# EAGLE design Weather Box (EAGLE 8.5.2)
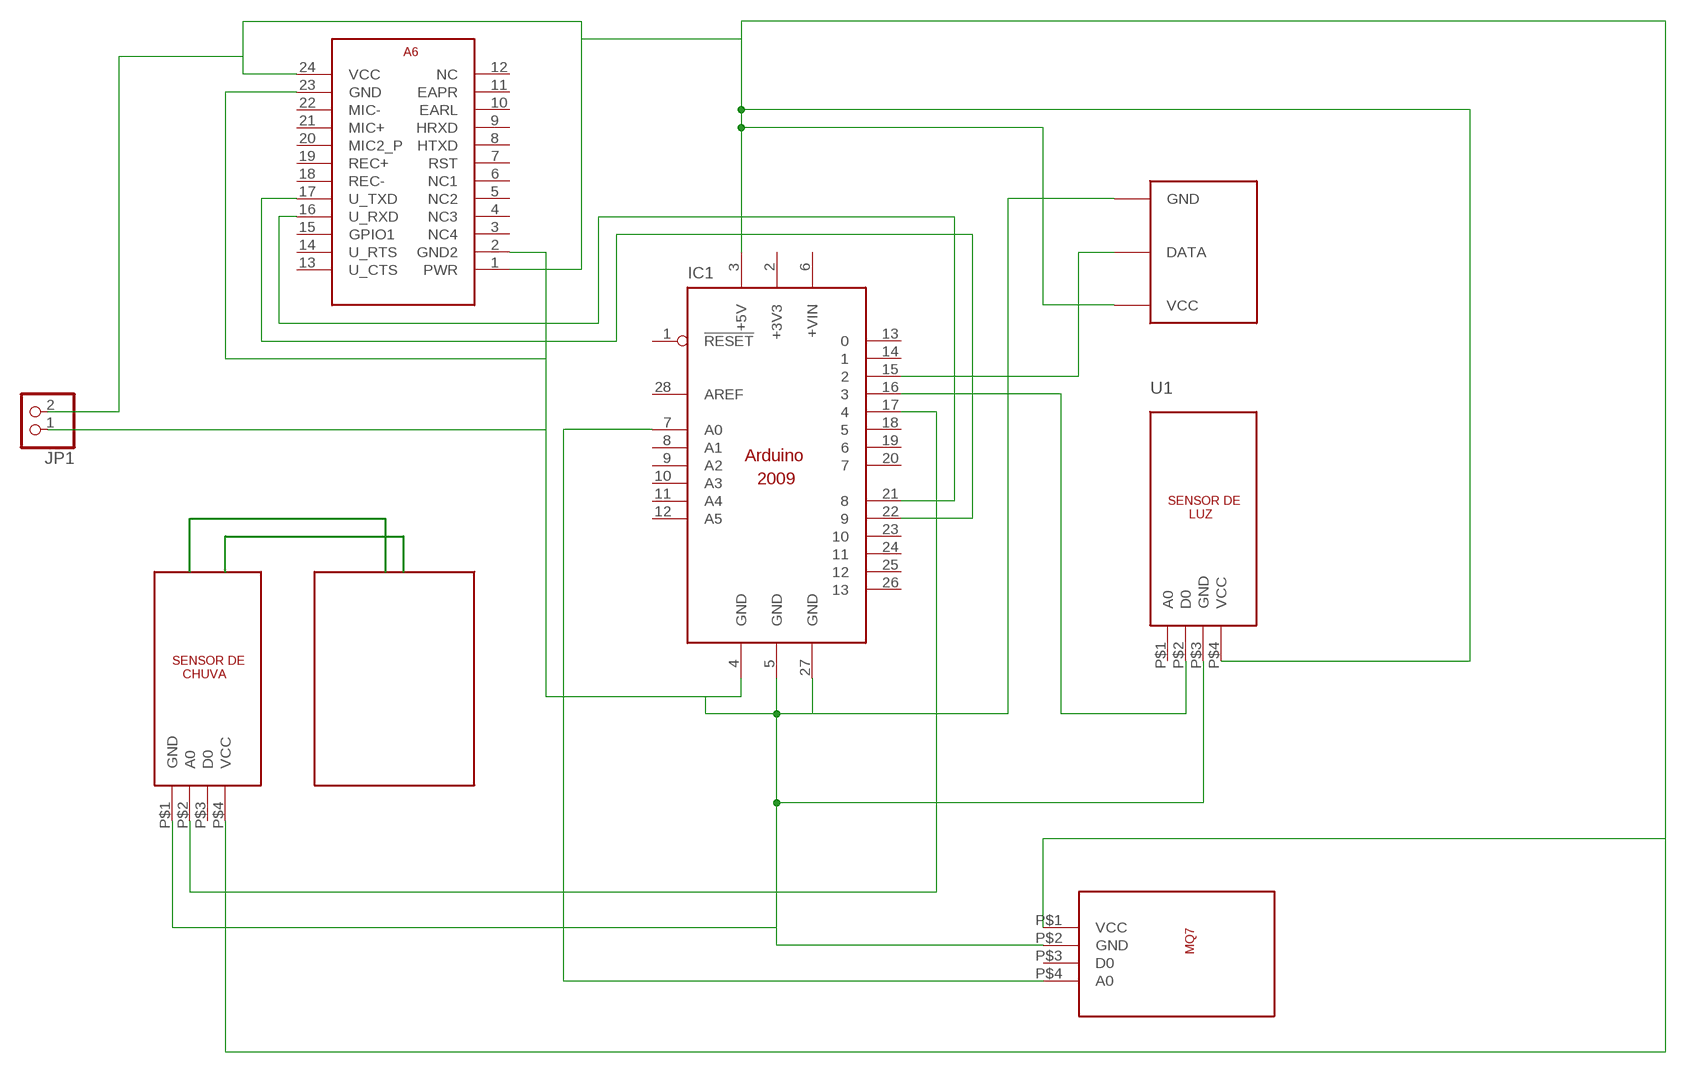
[diagram p0: schematic, sheet 1]

## Parts
IC1  ARDUINO2009_10  [ARDUINO2009]
JP1  PINHD-1X2  [1X02]
SHT1  DHT11DHT11-UPRIGHT  [DHT11-UP]
U1  LDRLDR-UPRIGHT  [LDR-UP]
U2  A6GPRS  [A6_MODULE_V3]
U3  RAINLDR-UPRIGHT  [RAIN-UP]
U4  MQ7MQ7-UPRIGHT  [MQ7-UP]

## Nets
N$1: IC1.7(A0) U4.P$4(A0)
N$3: IC1.3(+5V) JP1.2 SHT1.P$1(VCC) U1.P$4(VCC) U2.1(PWR) U2.24(VCC) U3.P$4(VCC) U4.P$1(VCC)
N$5: IC1.22 U2.17(U_TXD)
N$6: IC1.21 U2.16(U_RXD)
N$7: IC1.4(GND) IC1.5(GND) IC1.27(GND) JP1.1 SHT1.P$4(GND) U1.P$3(GND) U2.2(GND2) U2.23(GND) U3.P$1(GND) U4.P$2(GND)
N$9: IC1.17 U3.P$2(A0)
N$13: IC1.16 U1.P$2(D0)
N$14: IC1.15 SHT1.P$3(DATA)
Unconnected: IC1.1(!RESET) IC1.6(+VIN) IC1.8(A1) IC1.9(A2) IC1.10(A3) IC1.11(A4) IC1.12(A5) IC1.13 IC1.14 IC1.18 IC1.19 IC1.20 IC1.23 IC1.24 IC1.25 IC1.26 IC1.28(AREF) U1.P$1(A0) U2.3(NC4) U2.4(NC3) U2.5(NC2) U2.6(NC1) U2.7(RST) U2.8(HTXD) U2.9(HRXD) U2.10(EARL) U2.11(EAPR) U2.12(NC) U2.13(U_CTS) U2.14(U_RTS) U2.15(GPIO1) U2.18(REC-) U2.19(REC+) U2.20(MIC2_P) U2.21(MIC+) U2.22(MIC-) U3.P$3(D0) U4.P$3(D0)

## Power pins joined to a net without a drawn wire
+3V3: IC1.2(+3V3)

## Library data of the parts
IC1 = arduino:ARDUINO2009_1: The Arduino Duemilanove ("2009") is a microcontroller board based on the ATmega168 or ATmega328. - 14 digital input/output pins (of which 6 can be used as PWM outputs) - 6 analog inputs, a 16 MHz crystal oscillator - USB connection - power jack - ISP header - reset button It contains everything needed to support the microcontroller; simply connect it to a computer with a USB cable or power it with a AC-to-DC adapter or battery to get started http://arduino.cc/en/Main/ArduinoBoardDuemilanove
JP1 = pinhead:PINHD-1X2: PIN HEADER
SHT1 = DHT11:DHT11
U1 = Sensor de Luz:LDR
U2 = A6 gprs:A6GPRS
U3 = Sensor de chuva:RAIN
U4 = MQ7:MQ7

## Board
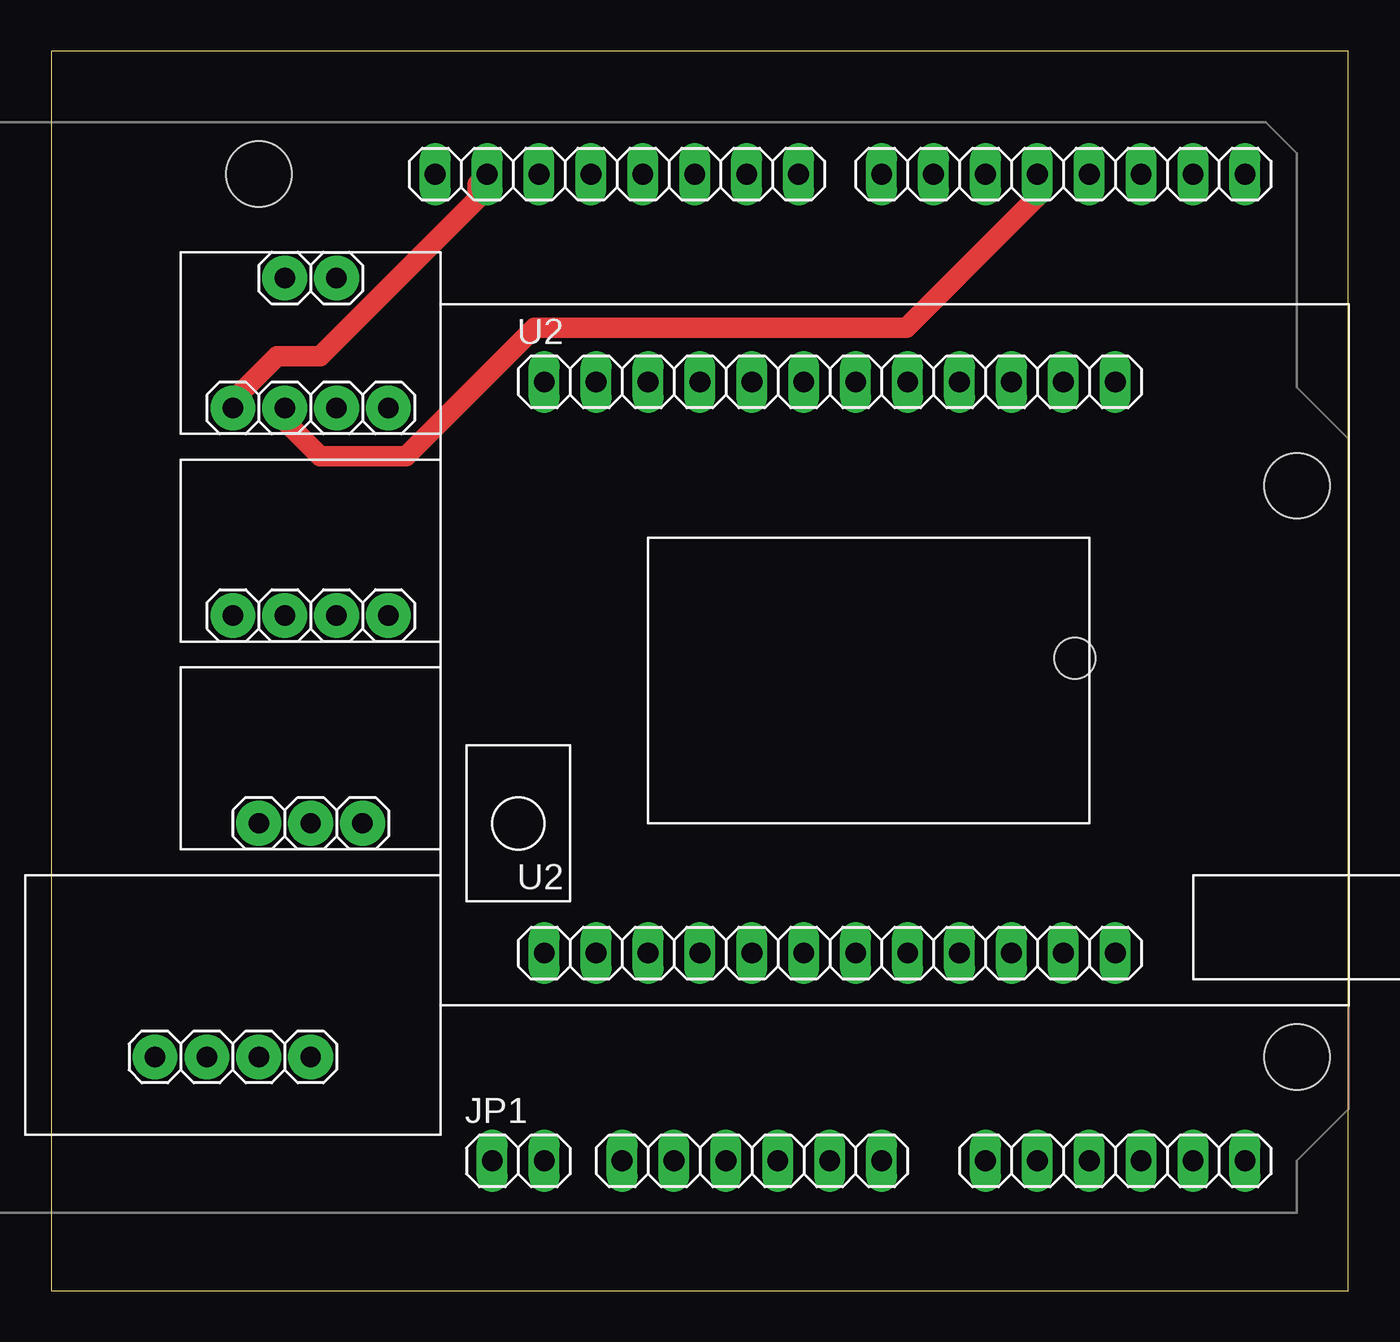
[diagram p1: board, top side]
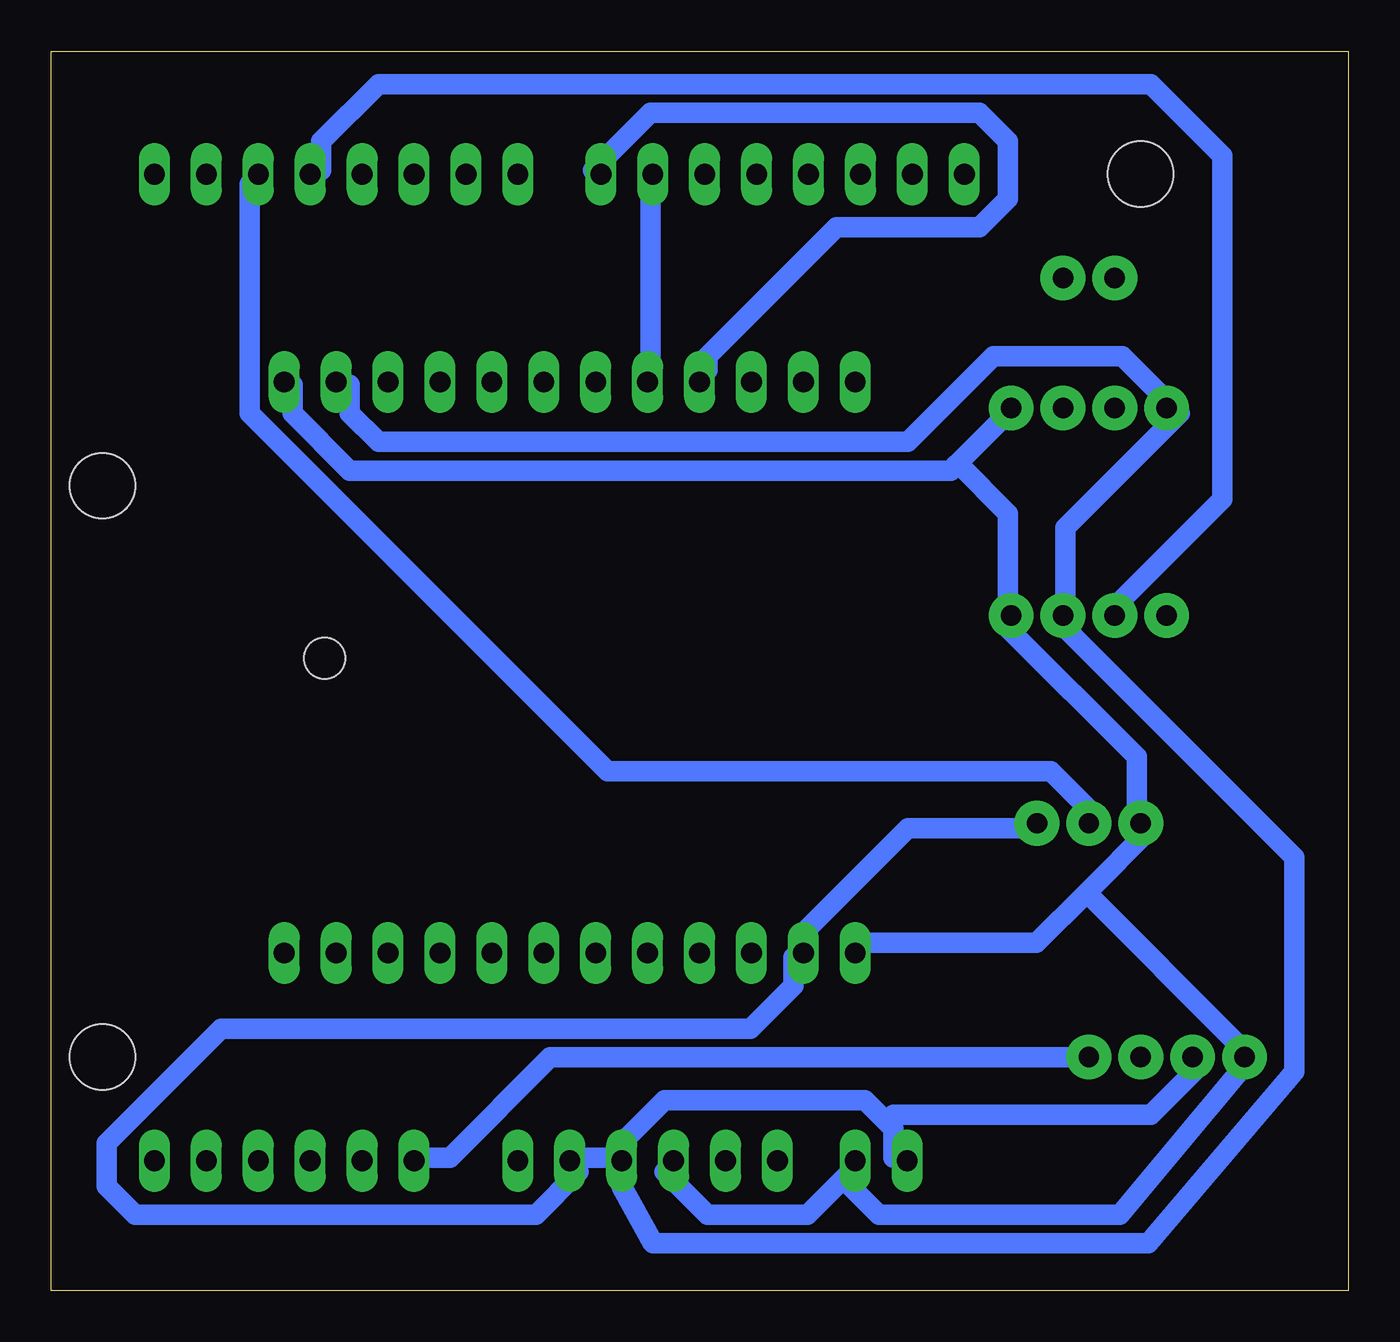
[diagram p2: board, bottom side, seen from below]

Size 63.48 x 60.63 mm. Coordinates in mm from the lower left corner, seen from the top.
Outline: 0,0 63.48,0 63.48,60.63 0,60.63 0,0
Copper layers (1*16): Top 0.035mm / dielectric 1.5mm / Bottom 0.035mm
Design rules "default *": minimum track width 1mm, minimum drill 0.35mm, track to track 0.4mm, track to pad 0.4mm, pad to pad 0.4mm, via to via 0.4mm, smd to smd 0.4mm, copper to edge 40mil, drill to drill 6mil, minimum pad ring 10mil, minimum via ring 8mil, stop-mask expansion 4mil, vias tented up to drill 0mil, thermal gap 10mil

### Footprints (pad centres in the part's own frame; a part is rotated, then mirrored left to right if it is on the bottom)
ARDUINO2009 = drill 1.016 long: 1 33.02,2.54; 2 35.56,2.54; 3 38.1,2.54; 4 40.64,2.54; 5 43.18,2.54; 6 45.72,2.54; 7 50.8,2.54; 8 53.34,2.54; 9 55.88,2.54; 10 58.42,2.54; 11 60.96,2.54; 12 63.5,2.54; 13 63.5,50.8; 14 60.96,50.8; 15 58.42,50.8; 16 55.88,50.8; 17 53.34,50.8; 18 50.8,50.8; 19 48.26,50.8; 20 45.72,50.8; 21 41.656,50.8; 22 39.116,50.8; 23 36.576,50.8; 24 34.036,50.8; 25 31.496,50.8; 26 28.956,50.8; 27 26.416,50.8; 28 23.876,50.8 | hole 3.2: 15.24,50.8; 66.04,35.56; 66.04,7.62 | hole 2: 55.17,27.114
1X02 = drill 1.016 long: 1 -1.27,0; 2 1.27,0
DHT11-UP = drill 1 pad 2.184: P$1 -1.27,0; P$3 1.27,0; P$4 3.81,0
LDR-UP = drill 1 pad 2.184: P$1 -2.54,0; P$2 0,0; P$3 2.54,0; P$4 5.08,0
A6_MODULE_V3 = drill 1.016 long: 1 -16.51,-13.97; 2 -13.97,-13.97; 3 -11.43,-13.97; 4 -8.89,-13.97; 5 -6.35,-13.97; 6 -3.81,-13.97; 7 -1.27,-13.97; 8 1.27,-13.97; 9 3.81,-13.97; 10 6.35,-13.97; 11 8.89,-13.97; 12 11.43,-13.97; 13 -16.51,13.97; 14 -13.97,13.97; 15 -11.43,13.97; 16 -8.89,13.97; 17 -6.35,13.97; 18 -3.81,13.97; 19 -1.27,13.97; 20 1.27,13.97; 21 3.81,13.97; 22 6.35,13.97; 23 8.89,13.97; 24 11.43,13.97
RAIN-UP = drill 1 pad 2.184: P$1 -2.54,0; P$2 0,0; P$3 2.54,0; P$4 5.08,0; P$5 0,6.35; P$6 2.54,6.35
MQ7-UP = drill 1 pad 2.184: P$1 -2.54,2.54; P$2 0,2.54; P$3 2.54,2.54; P$4 5.08,2.54

### Placement (x,y rotation side)
IC1  -5.08,3.81 0 top
JP1  22.86,6.35 0 top
SHT1  11.43,22.86 0 top
U1  11.43,33.02 0 top
U2  40.64,30.48 0 top
U3  11.43,43.18 0 top
U4  7.62,8.89 0 top

### Tracks (layer width: path | path; a pad name or v marks a point on that pad's centre or on a via)
N$1
  Bottom 1: IC1.7 45.36,6.51 43.96,6.51 39.06,11.41 13.16,11.41 U4.P$4
N$3
  Bottom 1: IC1.3 33.46,5.81 31.36,3.71 26.46,3.71 24.36,5.81 JP1.2 24.36,5.11 22.96,3.71 11.19,3.71 4.76,11.41 U4.P$1 5.46,12.11 12.81,19.46 | 12.81,19.46 9.66,22.61 SHT1.P$1 10.36,23.31 10.36,26.11 16.66,32.41 U1.P$4 16.66,33.11 16.66,38.01 19.11,40.46 | 12.81,19.46 15.26,17.01 23.66,17.01 U2.1 | 19.11,40.46 16.66,42.91 U3.P$4 | 19.11,40.46 19.46,40.11 48.86,40.11 51.66,42.91 51.66,44.31 U2.24
N$5
  Bottom 1: IC1.22 34.16,54.11 34.16,45.01 U2.17
N$6
  Bottom 1: U2.16 31.36,45.01 31.36,45.71 25.06,52.01 18.06,52.01 16.66,53.41 16.66,56.21 18.06,57.61 34.16,57.61 36.96,54.81 IC1.21
N$7
  Top 1: IC1.27 20.86,54.11 20.86,53.41 13.16,45.71 11.06,45.71 8.96,43.61 U3.P$1
  Bottom 1: SHT1.P$4 15.26,22.61 21.56,22.61 26.46,17.71 26.46,17.01 U2.2 27.16,16.31 27.16,14.91 29.26,12.81 55.16,12.81 60.76,7.21 60.76,5.11 59.36,3.71 39.76,3.71 37.66,5.81 IC1.5 37.66,6.51 35.56,6.51 | 22.61,8.26 23.66,9.31 33.46,9.31 35.56,7.21 35.56,6.51 | 22.61,8.26 22.26,7.91 22.26,6.51 JP1.1 | 35.56,6.51 IC1.4 35.56,5.11 34.03,2.31 9.79,2.31 2.66,10.71 2.66,21.21 13.86,32.41 U1.P$3 13.86,33.11 13.86,37.31 8.26,42.91 U3.P$1 8.96,43.61 11.06,45.71 17.36,45.71 21.56,41.51 47.46,41.51 48.86,42.91 48.86,44.31 U2.23 | U4.P$2 7.56,11.41 7.56,10.71 9.66,8.61 22.26,8.61 22.61,8.26
N$9
  Top 1: IC1.17 48.16,54.11 48.16,53.41 41.86,47.11 23.66,47.11 17.36,40.81 13.16,40.81 11.06,42.91 U3.P$2
N$13
  Bottom 1: IC1.16 50.26,54.81 50.26,56.21 47.46,59.01 9.66,59.01 6.16,55.51 6.16,38.71 11.76,33.11 U1.P$2
N$14
  Bottom 1: IC1.15 53.76,54.11 53.76,42.91 36.26,25.41 14.56,25.41 12.46,23.31 SHT1.P$3